# Altium schematic sheet SDCard.SchDoc
size Letter
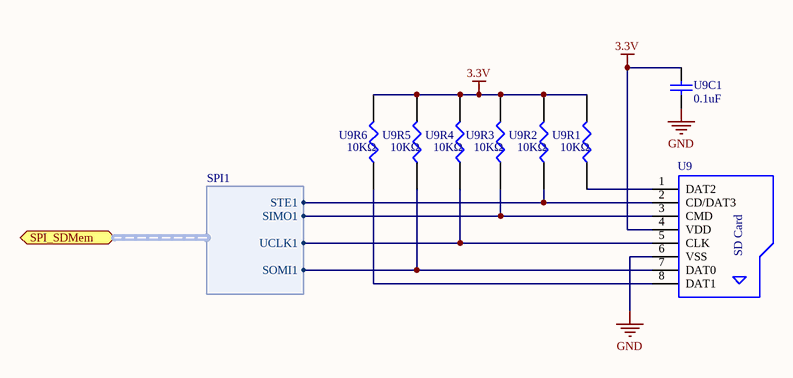
[diagram p0: SDCard.SchDoc]

## Parts
U9  WE-Card Connectors 693072010801  [693072010801]  (value not drawn)
U9C1  0.1uF  [0603 - CAP]
U9R1  10KΩ  [0805-RES]
U9R2  10KΩ  [0805-RES]
U9R3  10KΩ  [0805-RES]
U9R4  10KΩ  [0805-RES]
U9R5  10KΩ  [0805-RES]
U9R6  10KΩ  [0805-RES]

## Ports
SPI_SDMem (harness SPI1)

## Harnesses
SPI1: STE1, SIMO1, SOMI1, UCLK1

## Nets
3.3V: U9.4(VDD) U9C1.1 U9R1.2 U9R2.2 U9R3.2 U9R4.2 U9R5.2 U9R6.2
GND: U9.6(VSS) U9C1.2
NetU9_1: U9.1(DAT2) U9R1.1
NetU9_2: U9.2(CD/DAT3) U9R2.1 ; port SPI_SDMem.STE1
NetU9_3: U9.3(CMD) U9R3.1 ; port SPI_SDMem.SIMO1
NetU9_5: U9.5(CLK) U9R4.1 ; port SPI_SDMem.UCLK1
NetU9_7: U9.7(DAT0) U9R5.1 ; port SPI_SDMem.SOMI1
NetU9_8: U9.8(DAT1) U9R6.1

## Notes on the sheet
- Elaboró
- Fecha
- Nombre del artículo
- Revisó
- Aprobó
- Número de parte
- Revisión
- Escala
- N/A
- Sección afectada
- Descripción del cambio
- Lámina
- 1/1
- Tolerancias
- Ruta del archivo
- (in symbol WE-Card Connectors 693072010801) SD Card

## Library data of the parts
U9 = WE-Card Connectors 693072010801: WR-CRD Micro SD_Hinge / CONN MICRO SD CARD HINGED TYPE; Manufacturer: Würth Elektronik; Manufacturer Part Number: 693072010801; Supplier Part Number 1: 693072010801; Supplier 1: Wuth Elekronik; Supplier 2: Digi-Key; Supplier Part Number 2: 732-3820-1-ND
U9C1 = Cap: CAP CERAMIC 0.1UF, 25V, X7R, 0603; Manufacturer Part Number: CGJ3E2X7R1E104K080AA; Manufacturer: TDK Corporation; Value: 0.1uF; Supplier 1: Digi-Key; Supplier Part Number 1: 445-8129-1-ND
U9R1-U9R6 = RES1: 10 kOhms ±5% 0.125W, 1/8W Chip Resistor 0805; Manufacturer Part Number: RC0805JR-0710KL; Manufacturer: Yageo; Value: 10KΩ; Supplier 1: Digi-Key; Supplier Part Number 1: 311-10KARCT-ND